# EAGLE design Shield RELÉ TIMER (EAGLE 9.0.1)
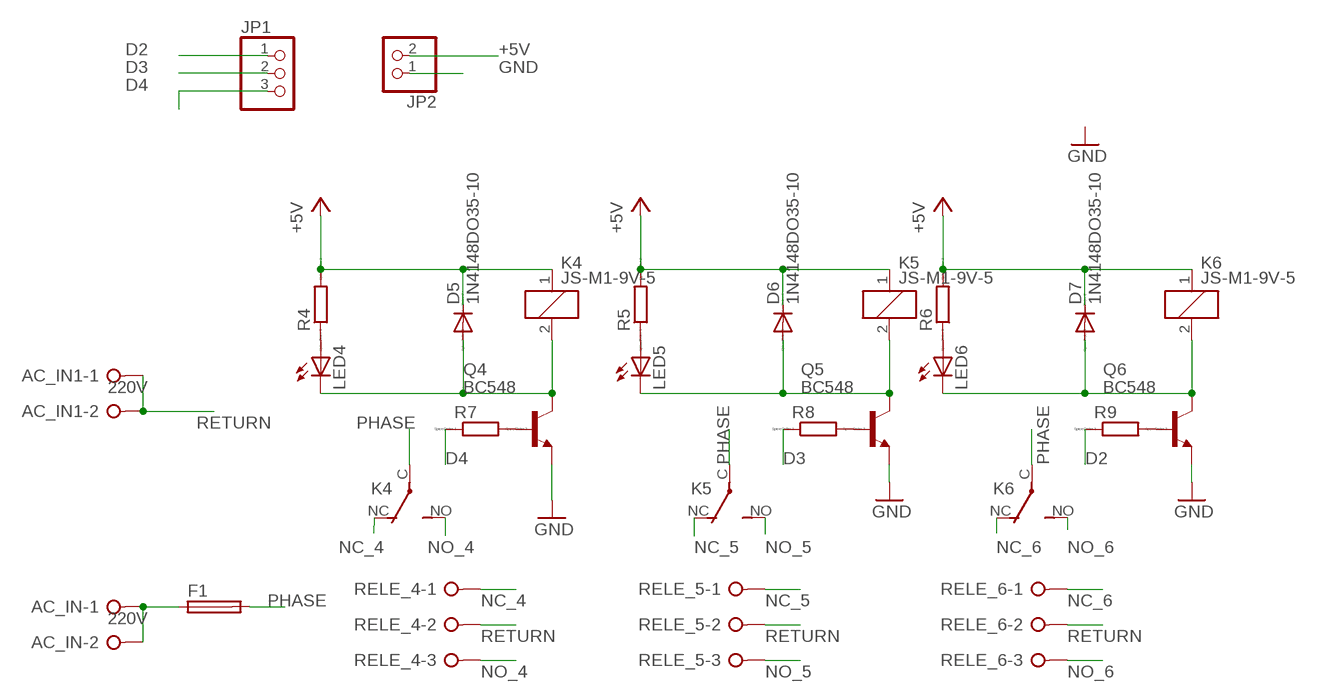
[diagram p0: schematic, sheet 1]

## Parts
AC_IN  220V  W237-02P  [W237-132]
AC_IN1  220V  W237-02P  [W237-132]
D5  1N4148DO35-10  [DO35-10]
D6  1N4148DO35-10  [DO35-10]
D7  1N4148DO35-10  [DO35-10]
F1  SH22,5A  [SH22,5A]
JP1  PINHD-1X3  [1X03]
JP2  PINHD-1X2  [1X02]
K4  JS-M1-9V-5  [JS-M]
K5  JS-M1-9V-5  [JS-M]
K6  JS-M1-9V-5  [JS-M]
LED4  LED5MM  [LED5MM]
LED5  LED5MM  [LED5MM]
LED6  LED5MM  [LED5MM]
Q4  BC548  [TO92-EBC]
Q5  BC548  [TO92-EBC]
Q6  BC548  [TO92-EBC]
R4  R0204/7  [0204/7]
R5  R0204/7  [0204/7]
R6  R0204/7  [0204/7]
R7  R0204/7  [0204/7]
R8  R0204/7  [0204/7]
R9  R0204/7  [0204/7]
RELE_4  W237-03P  [W237-133]
RELE_5  W237-03P  [W237-133]
RELE_6  W237-03P  [W237-133]

## Nets
+5V: D5.C D6.C D7.C JP2.2 K4.1 K5.1 K6.1 R4.2 R5.2 R6.2
D2: JP1.1 R9.1
D3: JP1.2 R8.1
D4: JP1.3 R7.1
GND: JP2.1 Q4.E Q5.E Q6.E
N$2: LED4.A R4.1
N$3: LED5.A R5.1
N$5: LED6.A R6.1
N$7: D5.A K4.2 LED4.K(C) Q4.C
N$10: D6.A K5.2 LED5.K(C) Q5.C
N$11: Q4.B R7.2
N$12: Q5.B R8.2
N$13: D7.A K6.2 LED6.K(C) Q6.C
N$14: Q6.B R9.2
N$16: AC_IN.1 AC_IN.2 F1.1
NC_4: K4.NC(2:O) RELE_4.1
NC_5: K5.NC(2:O) RELE_5.1
NC_6: K6.NC(2:O) RELE_6.1
NO_4: K4.NO(2:S) RELE_4.3
NO_5: K5.NO(2:S) RELE_5.3
NO_6: K6.NO(2:S) RELE_6.3
PHASE: F1.2 K4.C(2:P) K5.C(2:P) K6.C(2:P)
RETURN: AC_IN1.1 AC_IN1.2 RELE_4.2 RELE_5.2 RELE_6.2

## Library data of the parts
AC_IN AC_IN1 = con-wago-508:W237-02P: WAGO SREW CLAMP; OC_FARNELL: unknown; OC_NEWARK: unknown
D5-D7 = diode:1N4148: DIODE high speed (Philips)
F1 = fuse:SH22,5A: FUSE HOLDER grid 22,5mm, isolated cap OGN0031 8201, Schurter (Buerklin); MPN: 0031.7701.11; OC_FARNELL: unknown; OC_NEWARK: 04F1224
JP1 = pinhead:PINHD-1X3: PIN HEADER
JP2 = pinhead:PINHD-1X2: PIN HEADER
K4-K6 = relay:JS-M1*: Automotive Ultra-Miniature Power Relay NAiS Source: http://www.mew-europe.com/.. en_ds_61211_0000.pdf; OC_FARNELL: unknown; OC_NEWARK: unknown
LED4-LED6 = led:LED: LED OSRAM: - CHIPLED LG R971, LG N971, LY N971, LG Q971, LY Q971, LO R971, LY R971 LH N974, LH R974 LS Q976, LO Q976, LY Q976 LO Q996 - Hyper CHIPLED LW Q18S LB Q993, LB Q99A, LB R99A - SideLED LS A670, LO A670, LY A670, LG A670, LP A670 LB A673, LV A673, LT A673, LW A673 LH A674 LY A675 LS A676, LA A676, LO A676, LY A676, LW A676 LS A679, LY A679, LG A679 - Hyper Micro SIDELED® LS Y876, LA Y876, LO Y876, LY Y876 LT Y87S - SmartLED LW L88C, LW L88S LB L89C, LB L89S, LG L890 LS L89K, LO L89K, LY L89K LS L896, LA L896, LO L896, LY L896 - TOPLED LS T670, LO T670, LY T670, LG T670, LP T670 LSG T670, LSP T670, LSY T670, LOP T670, LYG T670 LG T671, LOG T671, LSG T671 LB T673, LV T673, LT T673, LW T673 LH T674 LS T676, LA T676, LO T676, LY T676, LB T676, LH T676, LSB T676, LW T676 LB T67C, LV T67C, LT T67C, LS T67K, LO T67K, LY T67K, LW E67C LS E67B, LA E67B, LO E67B, LY E67B, LB E67C, LV E67C, LT E67C LW T67C LS T679, LY T679, LG T679 LS T770, LO T770, LY T770, LG T770, LP T770 LB T773, LV T773, LT T773, LW T773 LH T774 LS E675, LA E675, LY E675, LS T675 LS T776, LA T776, LO T776, LY T776, LB T776 LHGB T686 LT T68C, LB T68C - Hyper Mini TOPLED® LB M676 - Mini TOPLED Santana® LG M470 LS M47K, LO M47K, LY M47K Source: http://www.osram.convergy.de LUXEON: - LUMILED® LXK2-PW12-R00, LXK2-PW12-S00, LXK2-PW14-U00, LXK2-PW14-V00 LXK2-PM12-R00, LXK2-PM12-S00, LXK2-PM14-U00 LXK2-PE12-Q00, LXK2-PE12-R00, LXK2-PE12-S00, LXK2-PE14-T00, LXK2-PE14-U00 LXK2-PB12-K00, LXK2-PB12-L00, LXK2-PB12-M00, LXK2-PB14-N00, LXK2-PB14-P00, LXK2-PB14-Q00 LXK2-PR12-L00, LXK2-PR12-M00, LXK2-PR14-Q00, LXK2-PR14-R00 LXK2-PD12-Q00, LXK2-PD12-R00, LXK2-PD12-S00 LXK2-PH12-R00, LXK2-PH12-S00 LXK2-PL12-P00, LXK2-PL12-Q00, LXK2-PL12-R00 Source: www.luxeon.com KINGBRIGHT: KA-3528ASYC Source: www.kingbright.com
Q4-Q6 = transistor-npn:BC548*: NPN Transistor
R4-R9 = eagle-ltspice:R: RESISTOR, European symbol; SPICEMODEL: NONE; SPICEPREFIX: R
RELE_4-RELE_6 = con-wago-508:W237-03P: WAGO SREW CLAMP; OC_FARNELL: unknown; OC_NEWARK: unknown

## Board
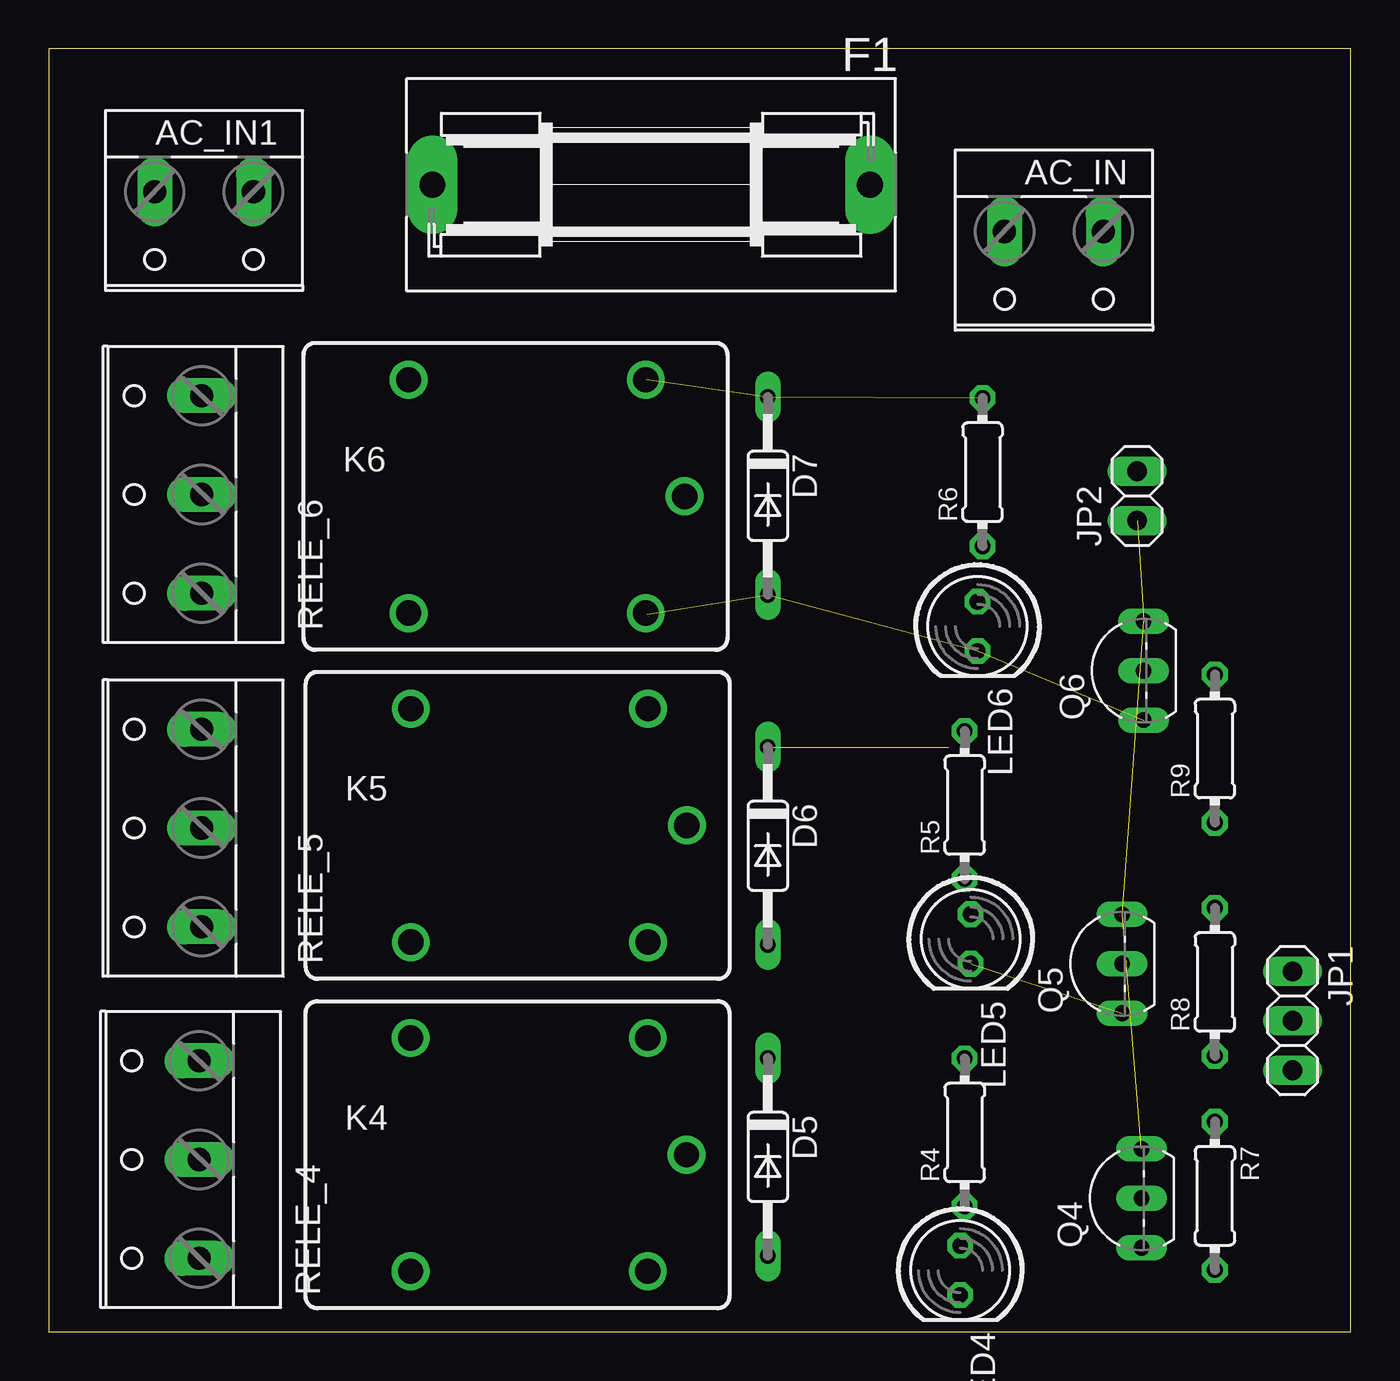
[diagram p1: board, top side]
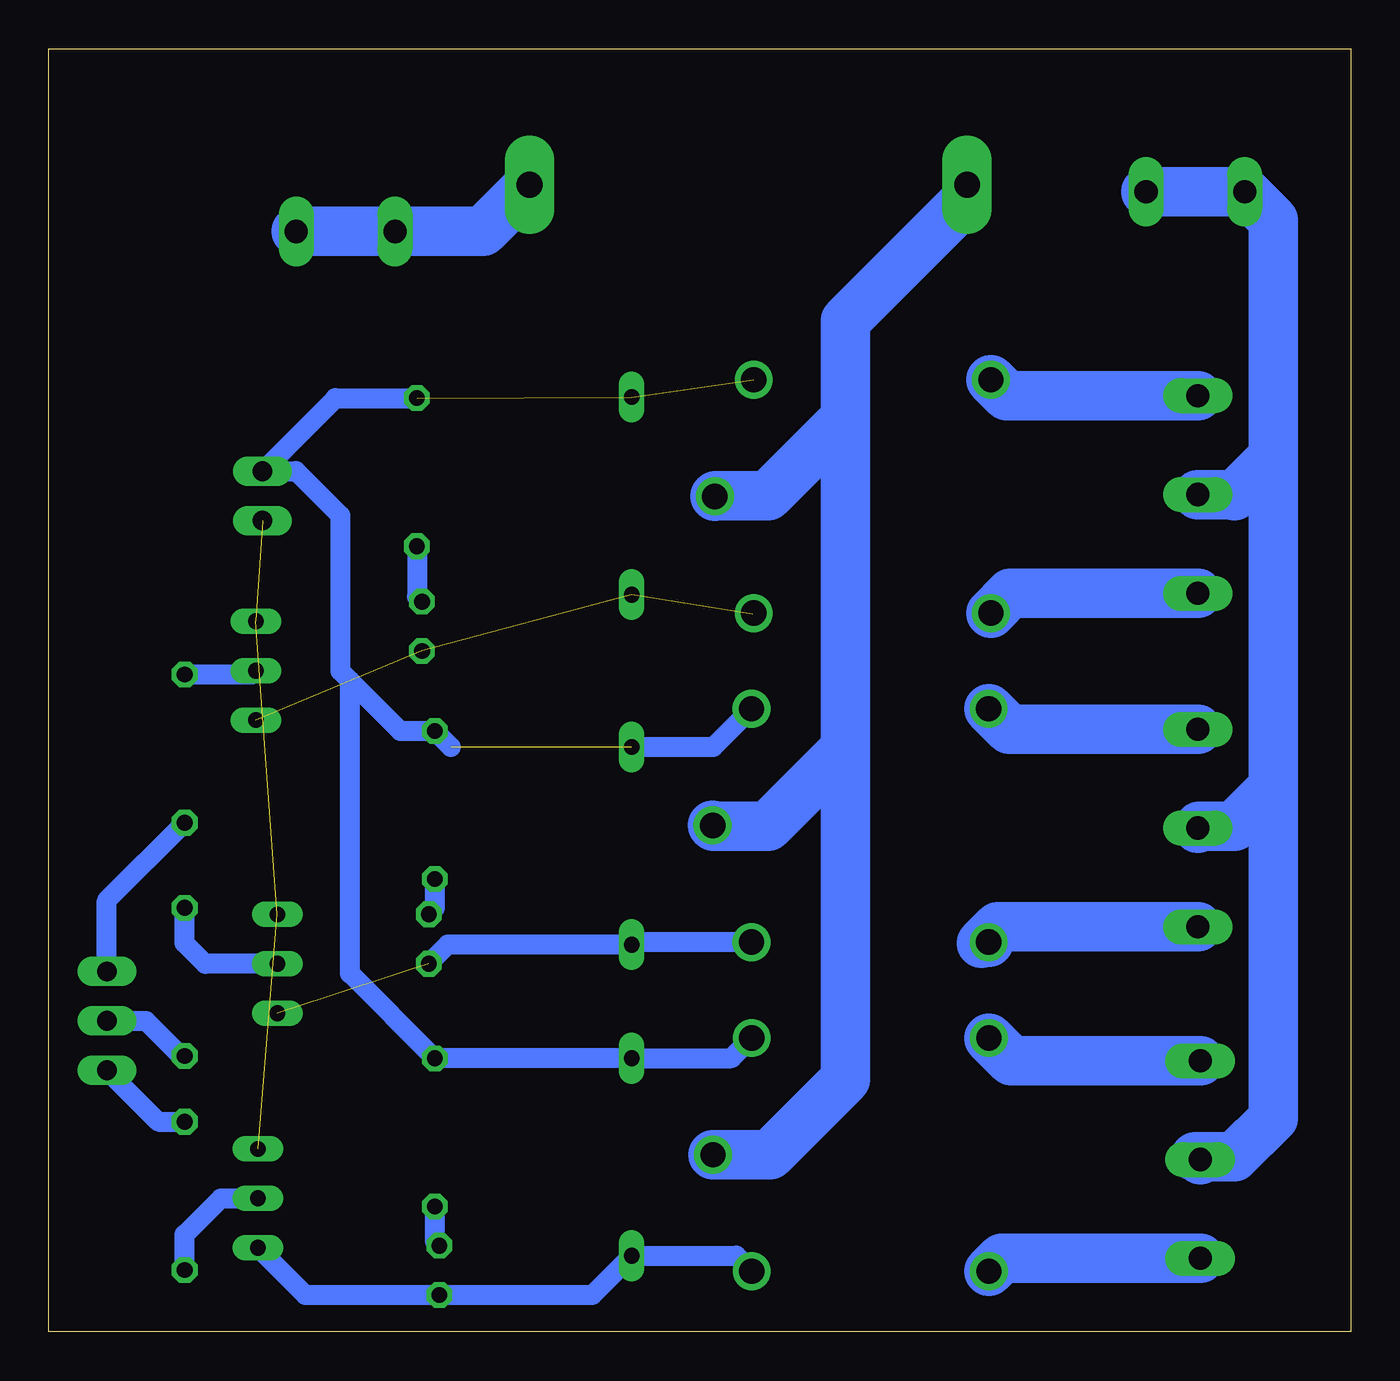
[diagram p2: board, bottom side, seen from below]

Size 67 x 66 mm. Coordinates in mm from the lower left corner, seen from the top.
Outline: 0,0 67,0 67,66 0,66 0,0
Copper layers (1*16): Top 0.035mm / dielectric 1.5mm / Bottom 0.035mm
Design rules "default *": minimum track width 0.8mm, minimum drill 0.8mm, track to track 0.4mm, track to pad 0.4mm, pad to pad 0.4mm, via to via 0.4mm, smd to smd 6mil, copper to edge 40mil, drill to drill 6mil, minimum pad ring 10mil, minimum via ring 8mil, stop-mask expansion 4mil, vias tented up to drill 0mil, thermal gap 0.8mm

### Footprints (pad centres in the part's own frame; a part is rotated, then mirrored left to right if it is on the bottom)
W237-132 = drill 1.194 long: 1 -2.54,-0.635; 2 2.54,-0.635
DO35-10 = drill 0.813 long: A 5.08,0; C -5.08,0
SH22,5A = drill 1.321 pad 2.54 long: 1 -11.252,0; 2 11.252,0
1X03 = drill 1.016 long: 1 -2.54,0; 2 0,0; 3 2.54,0
1X02 = drill 1.016 long: 1 -1.27,0; 2 1.27,0
JS-M = drill 1.3: 1 6.7,6; 2 6.7,-6; C 8.7,0; NC -5.5,-6; NO -5.5,6
LED5MM = drill 0.813 octagon: A -1.27,0; K 1.27,0
TO92-EBC = drill 0.813 long: B 0,-1.27; C -2.54,-1.27; E 2.54,-1.27
0204/7 = drill 0.813 octagon: 1 -3.81,0; 2 3.81,0
W237-133 = drill 1.194 long: 1 -5.08,-0.635; 2 0,-0.635; 3 5.08,-0.635

### Placement (x,y rotation side)
AC_IN  51.72,55.96 180 top
AC_IN1  8,58 180 top
D5  37,9 270 top
D6  37,25 270 top
D7  37,43 270 top
F1  31,59 180 top
JP1  64,16 270 top
JP2  56,43 90 top
K4  24.12,9.12 0 top
K5  24.14,26.05 0 top
K6  24.02,42.97 0 top
LED4  46.9,3.17 270 top
LED5  47.44,20.21 270 top
LED6  47.79,36.29 270 top
Q4  54.96,6.87 90 top
Q5  53.96,18.93 90 top
Q6  55.07,34.01 90 top
R4  47.13,10.26 90 top
R5  47.13,27.1 90 top
R6  48.05,44.22 90 top
R7  60,7 270 top
R8  60,18 90 top
R9  60,30 90 top
RELE_4  7.12,8.87 90 top
RELE_5  7.24,25.91 90 top
RELE_6  7.24,43.07 90 top

### Tracks (layer width: path | path; a pad name or v marks a point on that pad's centre or on a via)
+5V  (3 unrouted)
  Bottom 1.016: K4.1 31.86,14.08 D5.C R4.2 51.5,18.44 51.5,33.5 | R6.2 52.24,48.03 JP2.2 54.27,44.27 52,42 52,34 51.5,33.5 | K5.1 32.81,30.08 D6.C | 46.3,30.08 R5.2 48.91,30.91 51.5,33.5
D2
  Bottom 1.016: JP1.1 64,22.19 R9.1
D3
  Bottom 1.016: JP1.2 62,16 60.19,14.19 R8.1
D4
  Bottom 1.016: JP1.3 61.35,10.81 R7.1
GND  (3 unrouted)
N$2
  Bottom 1.016: R4.1 47.13,4.67 LED4.A
N$3
  Bottom 1.016: R5.1 47.13,21.79 LED5.A
N$5
  Bottom 1.016: R6.1 48.05,37.82 LED6.A
N$7
  Bottom 1.016: Q4.C 53.8,1.9 LED4.K 39.02,1.9 D5.A 31.63,3.92 K4.2
N$10  (1 unrouted)
  Bottom 1.016: K5.2 36.87,20.05 D6.A 46.46,19.92 LED5.K
N$11
  Bottom 1.016: R7.2 60,5 58.13,6.87 Q4.B
N$12
  Bottom 1.016: Q5.B 58.93,18.93 60,20 R8.2
N$13  (3 unrouted)
  Bottom 1.016: 30.77,36.92 K6.2
N$14
  Bottom 1.016: Q6.B 56.54,33.81 R9.2
N$16
  Bottom 2.54: F1.1 44.66,56.59 AC_IN.2 AC_IN.1
NC_4
  Bottom 2.54: RELE_4.1 17.95,3.79 K4.NC
NC_5
  Bottom 2.54: RELE_5.1 18.17,20.83 18.95,20.05 | 19,20 18.95,20.05 | 18.95,20.05 K5.NC
NC_6
  Bottom 2.54: RELE_6.1 17.51,37.99 K6.NC
NO_4
  Bottom 2.54: RELE_4.3 17.45,13.95 K4.NO
NO_5
  Bottom 2.54: RELE_5.3 17.58,30.99 K5.NO
NO_6
  Bottom 2.54: RELE_6.3 17.7,48.15 K6.NO
PHASE
  Bottom 2.54: F1.2 19.75,58.25 26,52 26,47 | 26,47 26,30 | 26,30 26,13 29.88,9.12 K4.C | K5.C 32.78,26 30,26 26,30 | K6.C 32.7,43 30,43 26,47
RETURN
  Bottom 2.54: AC_IN1.1 AC_IN1.2 4,57.17 4,46 4,45 | 7.88,9 6,9 4,11 4,28 | 8,9 7.88,9 | 7.88,9 RELE_4.2 | 4,45 4,28 | RELE_5.2 7.79,26 6,26 4,28 | RELE_6.2 6.07,43.07 6,43 4,45